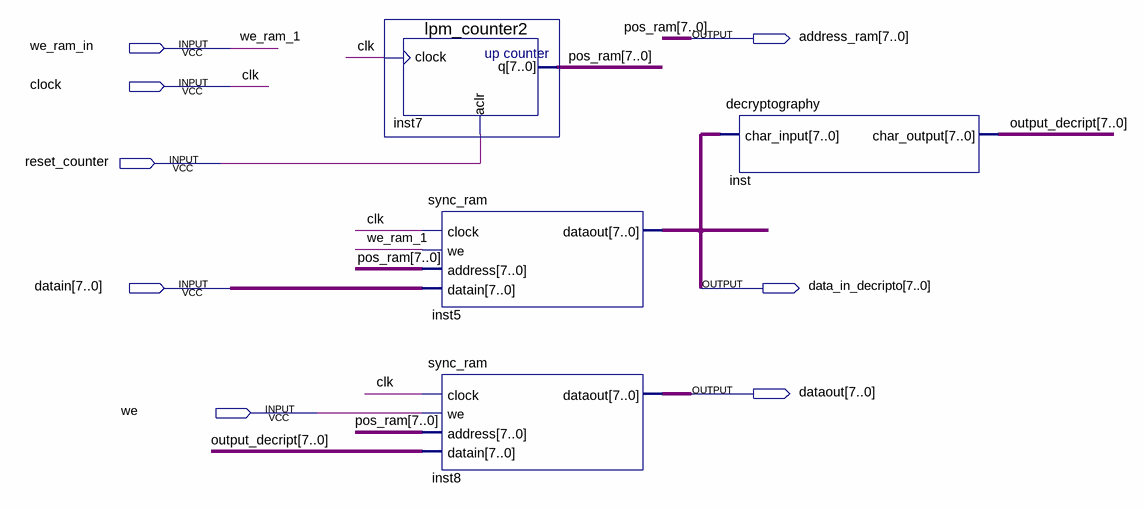
[diagram p0: schematic sheet]
// Quartus schematic projeto_final_descriptografia.bdf as structural Verilog: 4 symbols, 8 pins
module projeto_final_descriptografia (
  input  we_ram_in,
  input  clock,
  input  reset_counter,
  input  [7:0] datain,
  input  we,
  output [7:0] address_ram,
  output [7:0] data_in_decripto,
  output [7:0] dataout
);

  wire [7:0] output_decript;

  lpm_counter2 inst7 (.clock(clock), .aclr(reset_counter), .q(address_ram));
  sync_ram inst5 (.clock(clock), .we(we_ram_in), .address(address_ram), .datain(datain), .dataout(data_in_decripto));
  sync_ram inst8 (.clock(clock), .we(we), .address(address_ram), .datain(output_decript), .dataout(dataout));
  decryptography inst (.char_input(data_in_decripto), .char_output(output_decript));

  // Other names for the same wires on the sheet: clk = clock; pos_ram[7:0] = address_ram; we_ram_1 = we_ram_in
endmodule
